# Altium schematic sheet STeaMi-FP5-Microphone.SchDoc
size A3; DocumentNumber: 1; SheetNumber: 6; SheetTotal: 16
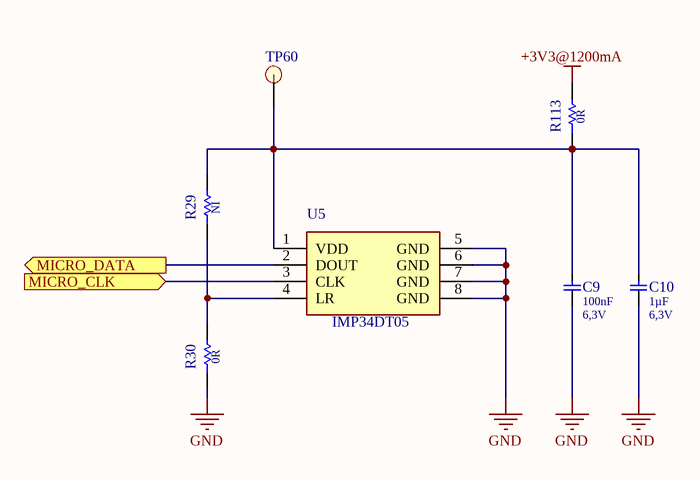
[diagram p0: STeaMi-FP5-Microphone.SchDoc]

## Parts
C9  Capacitance: 100nF  Voltage: 6,3V  [0402-CAP]
C10  Capacitance: 1µF  Voltage: 6,3V  [0402-CAP]
R29  (no value)  [RESC1005X40N_0402]
R30  Resistance: 0R  [RESC1005X40N_0402]
R113  Resistance: 0R  [RESC1005X40N_0402]
TP60  PAD  [Testpoint 1mm]  (value not drawn)  (no BOM)
U5  (no value)  [IMP34DT05]

## Ports
MICRO_CLK (in), MICRO_DATA (out)

## Nets
+3V3@1200mA: R113.2
GND: C9.1 C10.1 R30.1 U5.5(GND) U5.6(GND) U5.7(GND) U5.8(GND)
MICRO_CLK: U5.3(CLK) ; port MICRO_CLK
MICRO_DATA: U5.2(DOUT) ; port MICRO_DATA
NetC9_2: C9.2 C10.2 R29.2 R113.1 TP60.1 U5.1(VDD)
NetR29_1: R29.1 R30.2 U5.4(LR)

## Notes on the sheet
- Le présent document est la propriété exclusive de SmartEmbed. Remis à titre confidentiel, il ne peut être communiqué
- IND
- DATE
- DESCRIPTION
- VISA
- à des tiers, ni utilisé ou reproduit qu'en stricte conformité d'autorisations expresses préalables.
- Etabli le:
- Verifié le:
- Validé le:
- Par:
- Page:
- /
- Pépinière CleanTech Domaine du Petit Arbois Avenue Louis Philibert BP 80058 13792 AIX-EN-PROVENCE CEDEX 3
- REFERENCE
- DESIGNATION

## Library data of the parts
C9 = 100nF-10%-6,3V-X5R-0402: CAP CER 100nF 6,3V X5R 0402; Manufacturer: Kyocera AVX; Manufacturer Part Number: 0402YD104KAT2A; Populated: True; std Package: 0402; Tolerence: 0,1; Vérification: Non; Created by: EAG; Creation Date: 18/10/2021; Checked by: *; Part Number: 100nF-10%-6,3V-X5R-0402; Dielectric: X5R; Digikey: 478-1126-1-ND; Mouser: 581-0402YD104K; Switch possibility: True
C10 = 1µF-10%-6,3V-X5R-0402: CAP CER 1µF 6,3V X5R 0402; Manufacturer: Taiyo Yuden; Manufacturer Part Number: JMK105BJ105KV-F; Populated: True; std Package: 0402; Tolerence: 0,1; Vérification: Non; Created by: EAG; Creation Date: 08/04/2021; Checked by: *; Part Number: 1µF-10%-6,3V-X5R-0402; Dielectric: X5R; Mouser: 963-JMK105BJ105KV-F; Switch possibility: True
R29 = NI-1%-0,1W-0603: NI; Populated: True; Power: 0,1; Nom vérificateur: Non; std Package: 0603; Tolerence: 0,01; Created by: MSA; Creation Date: 20/03/2019; Manufacturer: -; Manufacturer Part Number: -; Resistance: NI; Part Number: NI-1%-0,1W-0603; Digikey: -; Farnell: -; Mouser: -; RS: -; Switch possibility: True
R30 R113 = 0R-5%-0,0625W-0402: RES CMS 0R5%-0,0625W-0402; Manufacturer: Yageo; Manufacturer Part Number: RC0402JR-100RL; Populated: True; Power: 0,0625; Nom vérificateur: Non; Prix: 0,09; std Package: 0402; Tolerence: 0,05; Created by: EAG; Creation Date: 02/12/2021; Part Number: 0R-5%-0,0625W-0402; Mouser: 603-RC0402JR-100RL; Switch possibility: True
TP60 = TESTPOINTPAD: Manufacturer: Smartembed; Switch possibility: False; Vérification: Non; Package: PAD_TEST; Part Number: TESTPOINTPAD; Created by: EAG; Creation Date: 11/03/2020; Digikey: -; Farnell: -; Manufacturer Part Number: TESTPOINT; Mouser: -; RS: -
U5 = IMP34DT05: MEMS audio sensor omnidirectional digital microphone dor industrial application; Manufacturer: STMicroelectronics; Populated: False; Switch possibility: False; Vérification: Non; Created by: EAG; Creation Date: 27/08/2021; Checked by: *; Ambient Temperature: ='Ambient temp'; Storage temperature: ='Storage temp'; Current: *; RoHs compliant: ='Rohs'; Datasheet: ='Datasheet'; ComponentLink1Description: Datasheet; ComponentLink1URL: https://www.st.com/resource/en/datasheet/imp34dt05.pdf; Manufacturer Part Number: IMP34DT05; Part Number: IMP34DT05; Mouser: 511-IMP34DT05TR